# Altium schematic sheet Protocol-Analyzer.SchDoc
size 431 x 279 mm; SheetNumber: 1; SheetTotal: 1; ENG_APP_DATE: --/--/--; DSN_APP_DATE: --/--/--; CHK_APP_DATE: --/--/--
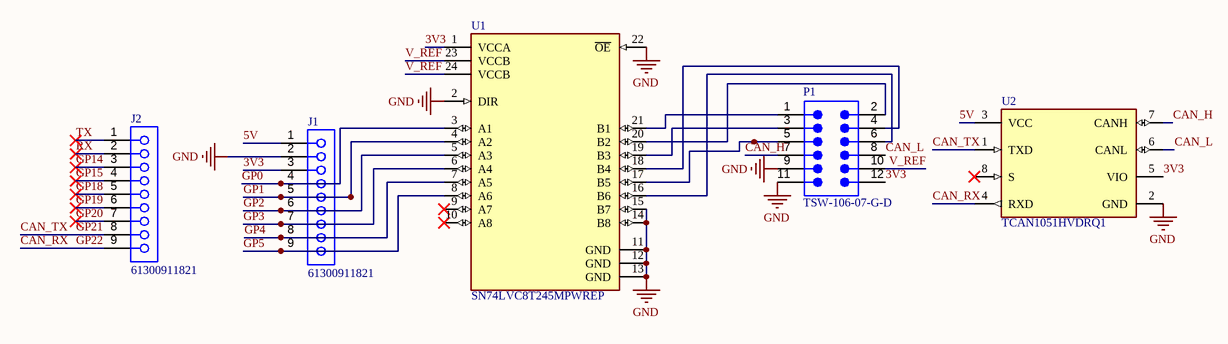
[diagram p0: Protocol-Analyzer.SchDoc]

## Parts
J1  61300911821  [61300911821]
J2  61300911821  [61300911821]
P1  TSW-106-07-G-D  [SMTC-TSW-106-07-X-D]
U1  SN74LVC8T245MPWREP  [FP-PW0024A-IPC_A]
U2  TCAN1051HVDRQ1  [FP-D0008B-IPC_C]

## Nets
GND: J1.2 P1.9 P1.11 U1.2(DIR) U1.11(GND) U1.12(GND) U1.13(GND) U1.14(B8) U1.15(B7) U1.22(~{OE}) U2.2(GND)
3V3: J1.3 P1.12 U1.1(VCCA) U2.5(VIO)
5V: J1.1 U2.3(VCC)
CAN_H: P1.7 U2.7(CANH)
CAN_L: P1.8 U2.6(CANL)
CAN_RX: J2.9 U2.4(RXD)  [also labelled GP22]
CAN_TX: J2.8 U2.1(TXD)  [also labelled GP21]
GP0: J1.4 U1.3(A1)
GP1: J1.5 U1.4(A2)
GP2: J1.6 U1.5(A3)
GP3: J1.7 U1.6(A4)
GP4: J1.8 U1.7(A5)
GP5: J1.9 U1.8(A6)
GP14: J2.3
GP15: J2.4
GP18: J2.5
GP19: J2.6
GP20: J2.7
RX: J2.2
TX: J2.1
V_REF: P1.10 U1.23(VCCB) U1.24(VCCB)
NetP1_1: P1.1 U1.21(B1)
NetP1_2: P1.2 U1.20(B2)
NetP1_3: P1.3 U1.19(B3)
NetP1_4: P1.4 U1.18(B4)
NetP1_5: P1.5 U1.17(B5)
NetP1_6: P1.6 U1.16(B6)

Not connected (* = marked no-connect by the designer): U1 9(A7)* 10(A8)*; U2 8(S)*

## Notes on the sheet
- DWG. NO.
- REV.
- SHT.
- THIS DOCUMENT AND THE DATA DISCLOSED HEREIN OR HEREWITH IS THE PROPERTY OF ALTIUM LIMITED AND MAY BE FREELY DISTRIBUTED IN WHOLE. NO RIGHTS ARE RESERVED OR EXPRESS OR IMPLIED WARANTEE GIVEN.
- REVISION
- DESCRIPTION
- DATE
- APPROVED
- ENG:
- APPROVALS
- PROJECT
- DSN:
- CHK:
- REFERENCE DOCUMENTS
- PROJECT REVISION:
- TITLE
- DOCUMENT REVISION:
- DESIGN ITEM:
- BOM:
- FAB DWG:
- PCB DWG:
- ASSY DWG:
- SCALE:
- SIZE
- B
- CAGE CODE
- FILE NAME
- DWG NO.
- SHEET
- OF
- REV

## Library data of the parts
J1 J2 = CMP-1502-01331-4: THT Vertical Socket Header WR-PHD, Pitch 2.54 mm, Single Row, 9 pins; Gender: Female; Operating Supply Voltage: 250V; Contact Resistance: 20mΩ; Current Rating: 3A; Number of Pins: 9; Lead Pitch: 2.54mm; Orientation: Vertical
P1 = CMP-1024-00379-1: 0.025" SQ Post Header, Through-hole, Vertical, -55 to 125 degC, 2.54 mm Pitch, 12-Pin, Male, RoHS; Manufacturer: Samtec; Pitch: 2.54 mm; ComponentLink1URL: http://www.samtec.com; DatasheetVersion: F-214; ComponentLink3URL: http://www.samtec.com/documents/webfiles/cpdf/TSW-XXX-XX-XXX-X-XX-XXX-MKT.pdf; PackageVersion: DM, 8/1988; Mounting Technology: Through-hole; ComponentLink1Description: Manufacturer URL; Orientation: Vertical; PackageDescription: .025[0.64] SQ. Post Terminal Strip Assembly; ComponentLink2URL: http://www.samtec.com/documents/webfiles/pdf/TSW_TH.PDF; RoHS: True; ComponentLink3Description: Package Specification; ComponentLink2Description: Datasheet; PackageReference: TSW-106-07-X-D; Temperature Range: -55 to 125 degC; PartNumber: TSW-106-07-G-D
U1 = CMP-04899-000093-1: IC TRNSLTR BIDIRECTIONAL 24TSSOP; Data Rate: 500Mbps; Number of Elements: 1; High Level Output Current: -32mA; Number of Bits: 8; Propagation Delay: 8.2ns; Quiescent Current: 15uA; Max Supply Voltage: 5.5V; Output Current: 32mA; Turn-On Delay Time: 40ns; Min Supply Voltage: 1.65V; Output Type: 3-STATE; Logic Function: Translator; Polarity: Non-Inverting; Technology: CMOS; Series: 74LVC; Lead Free: Lead Free; Max Operating Temperature: 125°C; Case/Package: TSSOP; Min Operating Temperature: -55°C; Radiation Hardening: No; Low Level Output Current: 32mA; Number of Channels: 8; Number of Pins: 24; Number of Inputs: 8; Packaging: Tape and Reel; Number of Outputs: 8; Package Quantity: 1; Mount: Surface Mount; REACH SVHC: No SVHC; RoHS Compliant: Yes; Direction: Bidirectional; Weight: 0.003157oz
U2 = CMP-04872-000101-1: IC TRANSCEIVER HALF 1/1 8SOIC; Max Supply Voltage: 5.5V; Min Supply Voltage: 4.5V; Interface: CAN; Case/Package: SOIC; Packaging: Cut Tape; Number of Pins: 8; RoHS Compliant: Yes; Max Operating Temperature: 125°C; REACH SVHC: No SVHC; Lead Free: Lead Free; Min Operating Temperature: -55°C